# EAGLE design pointModule (EAGLE 5.11)
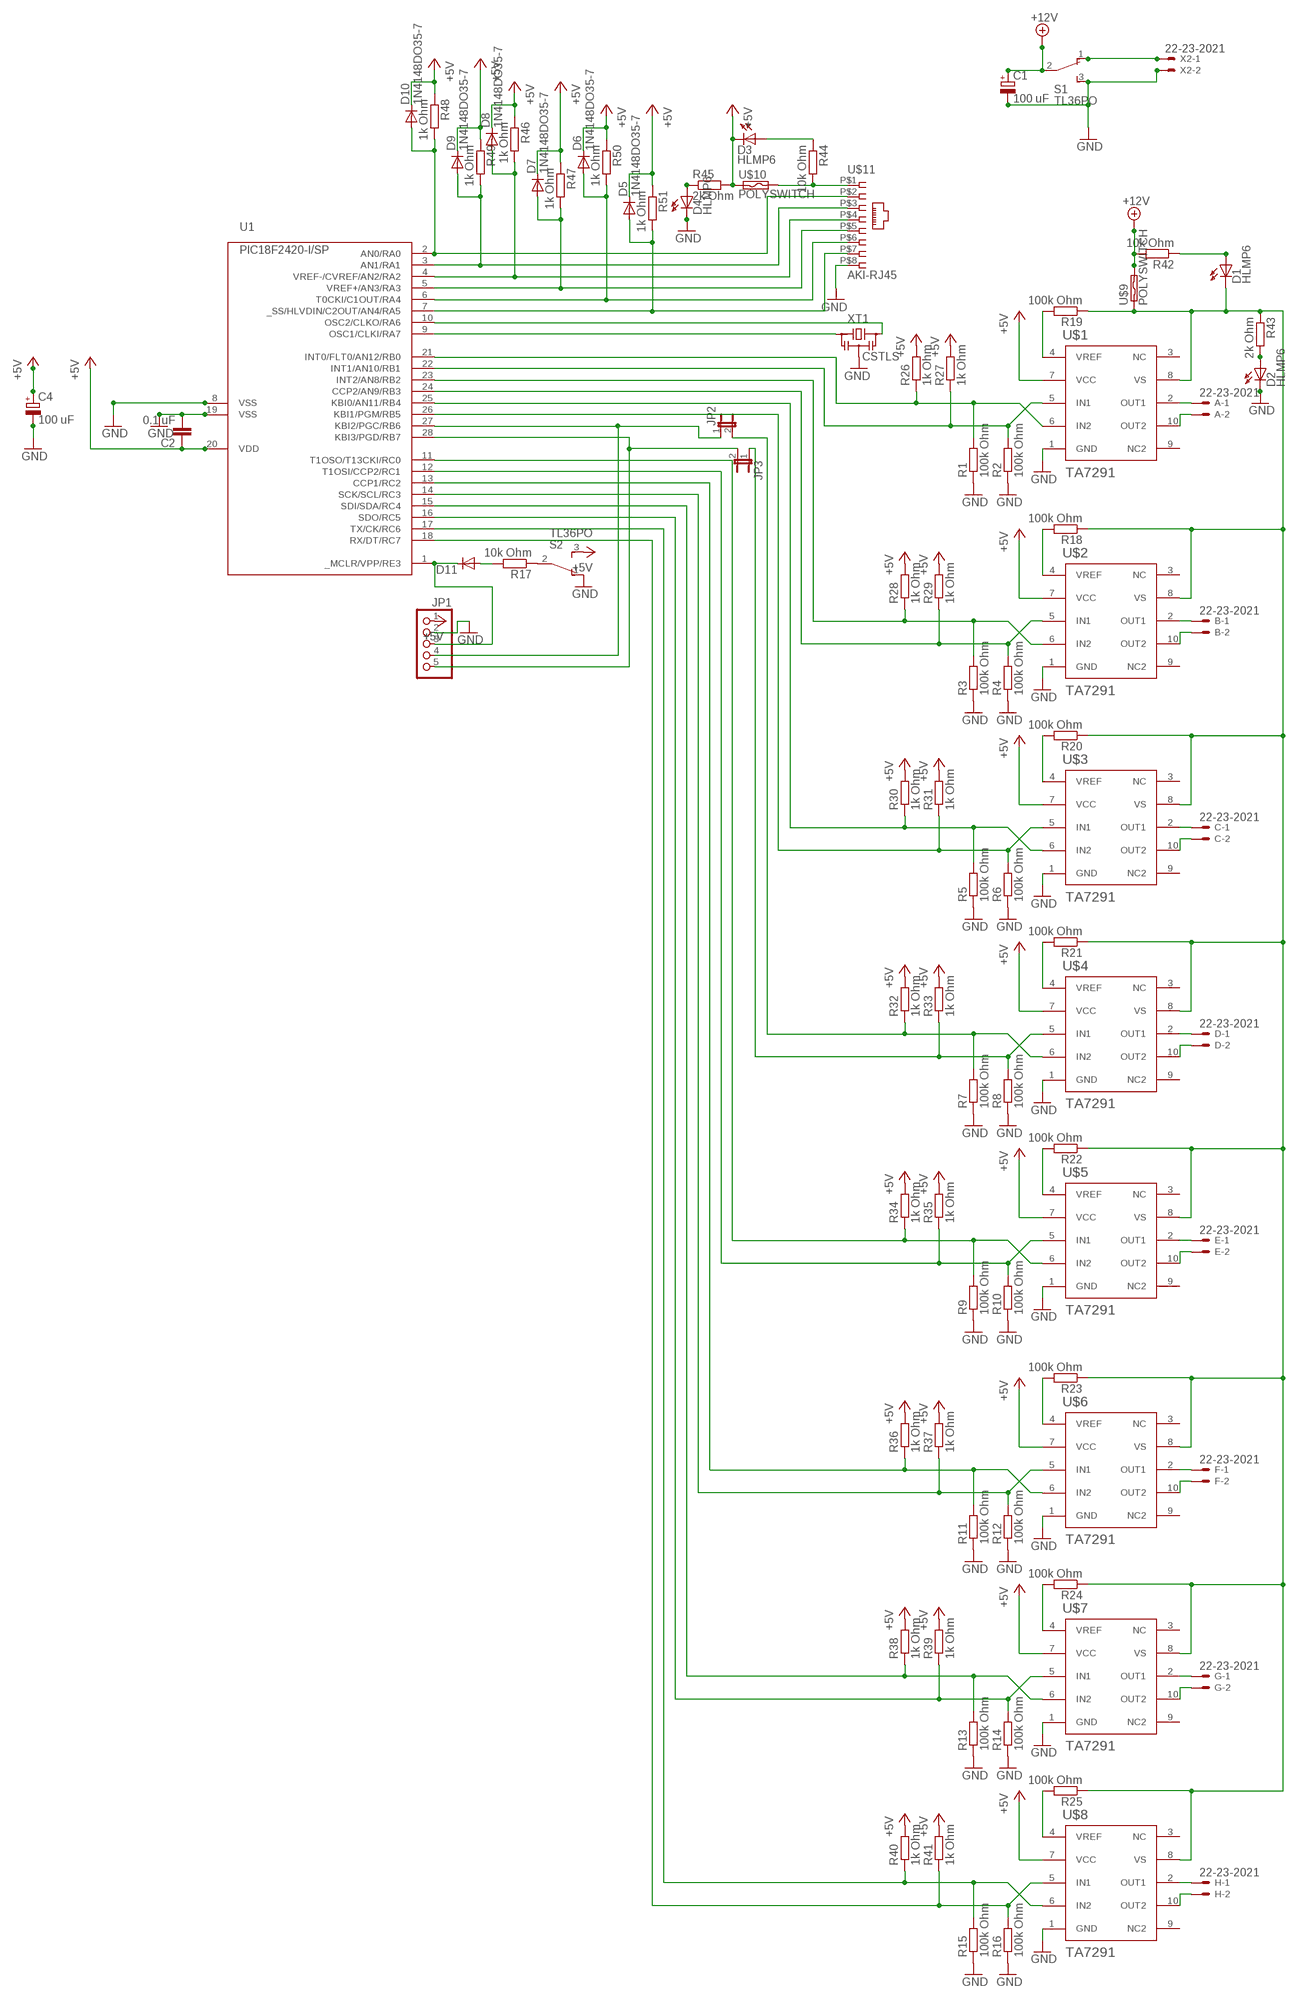
[diagram p0: schematic, sheet 1]

## Parts
A  22-23-2021  [22-23-2021]
B  22-23-2021  [22-23-2021]
C  22-23-2021  [22-23-2021]
C1  100 uF  CPOL-EUE2.5-5  [E2,5-5]
C2  0.1 uF  C2.5/2  [C2.5-2]
C4  100 uF  CPOL-EUE2.5-5  [E2,5-5]
D  22-23-2021  [22-23-2021]
D1  HLMP6  [HLMP6]
D2  HLMP6  [HLMP6]
D3  HLMP6  [HLMP6]
D4  HLMP6  [HLMP6]
D5  1N4148DO35-7  DIODE-D-2.5  [D-2.5]
D6  1N4148DO35-7  DIODE-D-2.5  [D-2.5]
D7  1N4148DO35-7  DIODE-D-2.5  [D-2.5]
D8  1N4148DO35-7  DIODE-D-2.5  [D-2.5]
D9  1N4148DO35-7  DIODE-D-2.5  [D-2.5]
D10  1N4148DO35-7  DIODE-D-2.5  [D-2.5]
D11  DIODE-D-2.5  [D-2.5]
E  22-23-2021  [22-23-2021]
F  22-23-2021  [22-23-2021]
G  22-23-2021  [22-23-2021]
H  22-23-2021  [22-23-2021]
JP1  PINHD-1X5  [1X05]
JP2  JP1E  [JP1]
JP3  JP1E  [JP1]
R1  100k Ohm  R-EU_0204/2V  [0204V]
R2  100k Ohm  R-EU_0204/2V  [0204V]
R3  100k Ohm  R-EU_0204/2V  [0204V]
R4  100k Ohm  R-EU_0204/2V  [0204V]
R5  100k Ohm  R-EU_0204/2V  [0204V]
R6  100k Ohm  R-EU_0204/2V  [0204V]
R7  100k Ohm  R-EU_0204/2V  [0204V]
R8  100k Ohm  R-EU_0204/2V  [0204V]
R9  100k Ohm  R-EU_0204/2V  [0204V]
R10  100k Ohm  R-EU_0204/2V  [0204V]
R11  100k Ohm  R-EU_0204/2V  [0204V]
R12  100k Ohm  R-EU_0204/2V  [0204V]
R13  100k Ohm  R-EU_0204/2V  [0204V]
R14  100k Ohm  R-EU_0204/2V  [0204V]
R15  100k Ohm  R-EU_0204/2V  [0204V]
R16  100k Ohm  R-EU_0204/2V  [0204V]
R17  10k Ohm  R-EU_0204/2V  [0204V]
R18  100k Ohm  R-EU_0204/2V  [0204V]
R19  100k Ohm  R-EU_0204/2V  [0204V]
R20  100k Ohm  R-EU_0204/2V  [0204V]
R21  100k Ohm  R-EU_0204/2V  [0204V]
R22  100k Ohm  R-EU_0204/2V  [0204V]
R23  100k Ohm  R-EU_0204/2V  [0204V]
R24  100k Ohm  R-EU_0204/2V  [0204V]
R25  100k Ohm  R-EU_0204/2V  [0204V]
R26  1k Ohm  R-EU_0204/2V  [0204V]
R27  1k Ohm  R-EU_0204/2V  [0204V]
R28  1k Ohm  R-EU_0204/2V  [0204V]
R29  1k Ohm  R-EU_0204/2V  [0204V]
R30  1k Ohm  R-EU_0204/2V  [0204V]
R31  1k Ohm  R-EU_0204/2V  [0204V]
R32  1k Ohm  R-EU_0204/2V  [0204V]
R33  1k Ohm  R-EU_0204/2V  [0204V]
R34  1k Ohm  R-EU_0204/2V  [0204V]
R35  1k Ohm  R-EU_0204/2V  [0204V]
R36  1k Ohm  R-EU_0204/2V  [0204V]
R37  1k Ohm  R-EU_0204/2V  [0204V]
R38  1k Ohm  R-EU_0204/2V  [0204V]
R39  1k Ohm  R-EU_0204/2V  [0204V]
R40  1k Ohm  R-EU_0204/2V  [0204V]
R41  1k Ohm  R-EU_0204/2V  [0204V]
R42  10k Ohm  R-EU_0204/2V  [0204V]
R43  2k Ohm  R-EU_0204/2V  [0204V]
R44  10k Ohm  R-EU_0204/2V  [0204V]
R45  2k Ohm  R-EU_0204/2V  [0204V]
R46  1k Ohm  R-EU_0204/2V  [0204V]
R47  1k Ohm  R-EU_0204/2V  [0204V]
R48  1k Ohm  R-EU_0204/2V  [0204V]
R49  1k Ohm  R-EU_0204/2V  [0204V]
R50  1k Ohm  R-EU_0204/2V  [0204V]
R51  1k Ohm  R-EU_0204/2V  [0204V]
S1  TL36PO  [TL3XPO]
S2  TL36PO  [TL3XPO]
U1  PIC18F2420-I/SP  [DIL28-3]
U$1  TA7291  [HSIP10]
U$2  TA7291  [HSIP10]
U$3  TA7291  [HSIP10]
U$4  TA7291  [HSIP10]
U$5  TA7291  [HSIP10]
U$6  TA7291  [HSIP10]
U$7  TA7291  [HSIP10]
U$8  TA7291  [HSIP10]
U$9  POLYSWITCH  [0207/2V]
U$10  POLYSWITCH  [0207/2V]
U$11  AKI-RJ45  [C-00159]
X2  22-23-2021  [22-23-2021]
XT1  CSTLS  [S3P]

## Nets
+5V: C2.1 C4.+ D3.K D5.C D6.C D7.C D8.C D9.C D10.C JP1.1 R26.2 R27.2 R28.2 R29.2 R30.2 R31.2 R32.2 R33.2 R34.2 R35.2 R36.2 R37.2 R38.2 R39.2 R40.2 R41.2 R45.2 R46.1 R47.1 R48.1 R49.1 R50.1 R51.1 S2.3(S) U1.20(VDD) U$1.7(VCC) U$2.7(VCC) U$3.7(VCC) U$4.7(VCC) U$5.7(VCC) U$6.7(VCC) U$7.7(VCC) U$8.7(VCC) U$10.1
+12V [12v]: C1.+ R42.2 S1.2(P) U$9.2
GND: C1.- C2.2 C4.- D2.K D4.K JP1.2 R1.1 R2.1 R3.1 R4.1 R5.1 R6.1 R7.1 R8.1 R9.1 R10.1 R11.1 R12.1 R13.1 R14.1 R15.1 R16.1 S1.3(S) S2.1(O) U1.8(VSS) U1.19(VSS) U$1.1(GND) U$2.1(GND) U$3.1(GND) U$4.1(GND) U$5.1(GND) U$6.1(GND) U$7.1(GND) U$8.1(GND) U$11.P$8 X2.2 XT1.P$2
N$1 [12v]: S1.1(O) X2.1
N$2 [signal]: D6.A R50.2 U1.6(T0CKI/C1OUT/RA4) U$11.P$6
N$3: D5.A R51.2 U1.7(_SS/HLVDIN/C2OUT/AN4/RA5) U$11.P$7
N$4: D11.C JP1.3 U1.1(_MCLR/VPP/RE3)
N$5: JP1.5 JP3.2 U1.28(KBI3/PGD/RB7)
N$6: R17.1 S2.2(P)
N$7: R18.2 U$2.4(VREF)
N$8: R1.2 R26.1 U1.21(INT0/FLT0/AN12/RB0) U$1.6(IN2)
N$9: U1.9(OSC1/CLKI/RA7) XT1.P$1
N$10: U1.10(OSC2/CLKO/RA6) XT1.P$3
N$11: R2.2 R27.1 U1.22(INT1/AN10/RB1) U$1.5(IN1)
N$12 [12v]: A.1 U$1.2(OUT1)
N$13 [12v]: A.2 U$1.10(OUT2)
N$14: D11.A R17.2
N$15: R4.2 R29.1 U1.24(CCP2/AN9/RB3) U$2.5(IN1)
N$16 [12v]: B.1 U$2.2(OUT1)
N$17 [12v]: B.2 U$2.10(OUT2)
N$18: JP1.4 JP2.1 U1.27(KBI2/PGC/RB6)
N$19: R6.2 R31.1 U1.26(KBI1/PGM/RB5) U$3.5(IN1)
N$20 [12v]: C.1 U$3.2(OUT1)
N$21 [12v]: C.2 U$3.10(OUT2)
N$23: JP3.1 R8.2 R33.1 U$4.5(IN1)
N$24 [12v]: D.1 U$4.2(OUT1)
N$25 [12v]: D.2 U$4.10(OUT2)
N$26 [signal]: D8.A R46.2 U1.4(VREF-/CVREF/AN2/RA2) U$11.P$4
N$27: R10.2 R35.1 U1.12(T1OSI/CCP2/RC1) U$5.5(IN1)
N$28 [12v]: E.1 U$5.2(OUT1)
N$29 [12v]: E.2 U$5.10(OUT2)
N$31: R12.2 R37.1 U1.14(SCK/SCL/RC3) U$6.5(IN1)
N$32 [12v]: F.1 U$6.2(OUT1)
N$33 [12v]: F.2 U$6.10(OUT2)
N$34 [signal]: D7.A R47.2 U1.5(VREF+/AN3/RA3) U$11.P$5
N$35: R14.2 R39.1 U1.16(SDO/RC5) U$7.5(IN1)
N$36 [12v]: G.1 U$7.2(OUT1)
N$37 [12v]: G.2 U$7.10(OUT2)
N$39: R16.2 R41.1 U1.18(RX/DT/RC7) U$8.5(IN1)
N$40 [12v]: H.1 U$8.2(OUT1)
N$41 [12v]: H.2 U$8.10(OUT2)
N$42: R19.2 U$1.4(VREF)
N$43 [signal]: D10.A R48.2 U1.2(AN0/RA0) U$11.P$2
N$44: R20.2 U$3.4(VREF)
N$45: R21.2 U$4.4(VREF)
N$46: R22.2 U$5.4(VREF)
N$47: R23.2 U$6.4(VREF)
N$48: R24.2 U$7.4(VREF)
N$49: R25.2 U$8.4(VREF)
N$50: R3.2 R28.1 U1.23(INT2/AN8/RB2) U$2.6(IN2)
N$51: R5.2 R30.1 U1.25(KBI0/AN11/RB4) U$3.6(IN2)
N$52: JP2.2 R7.2 R32.1 U$4.6(IN2)
N$53: R9.2 R34.1 U1.11(T1OSO/T13CKI/RC0) U$5.6(IN2)
N$54: R11.2 R36.1 U1.13(CCP1/RC2) U$6.6(IN2)
N$55: R13.2 R38.1 U1.15(SDI/SDA/RC4) U$7.6(IN2)
N$56: R15.2 R40.1 U1.17(TX/CK/RC6) U$8.6(IN2)
N$57 [signal]: D9.A R49.2 U1.3(AN1/RA1) U$11.P$3
N$66: D2.A R43.2
N$67: D1.A R42.1
N$68: R44.2 U$10.2 U$11.P$1
N$69: D3.A R44.1
N$70: D4.A R45.1
N$72 [12v]: D1.K R18.1 R19.1 R20.1 R21.1 R22.1 R23.1 R24.1 R25.1 R43.1 U$1.8(VS) U$2.8(VS) U$3.8(VS) U$4.8(VS) U$5.8(VS) U$6.8(VS) U$7.8(VS) U$8.8(VS) U$9.1
Unconnected: U$1.3(NC) U$1.9(NC2) U$2.3(NC) U$2.9(NC2) U$3.3(NC) U$3.9(NC2) U$4.3(NC) U$4.9(NC2) U$5.3(NC) U$5.9(NC2) U$6.3(NC) U$6.9(NC2) U$7.3(NC) U$7.9(NC2) U$8.3(NC) U$8.9(NC2)

## Library data of the parts
A B C D E F G H X2 = con-molex:22-23-2021: .100" (2.54mm) Center Header - 2 Pin; MF: MOLEX; MPN: 22-23-2021; OC_FARNELL: 1462926; OC_NEWARK: 25C3832
C1 C4 = rcl:CPOL-EU: POLARIZED CAPACITOR, European symbol
C2 = capacitor-wima:C: CAPACITOR naming: grid - package width
D1-D4 = display-hp:HLMP6: LED 2mm horizontal; MF: AGILENT TECHNOLOGIES; MPN: HLMP-6500; OC_FARNELL: 1652490; OC_NEWARK: 40K0088
D5-D11 = diode:DIODE-: DIODE
JP1 = pinhead:PINHD-1X5: PIN HEADER
JP2 JP3 = jumper:JP1E: JUMPER
R1-R51 = rcl:R-EU_: RESISTOR, European symbol
S1 S2 = switch:TL36PO: TINY SWITCH ON - ON Source: http://www2.produktinfo.conrad.com/datenblaetter/700000-724999/705152-da-01-de-Subminiaturschalter_TL_36YO.pdf
U1 = pic18fxx20:PIC18*2420: PIC18*2420 Microchip FLASH Microcontroller with A/D DEVICE FEATURES Feature PIC18*2420 Program Memory (bytes) 16384 Program Memory (instructions) 8192 Interupt Sources 19 I/O Ports Ports A, B, C, (E) Capture/Compare/PWM Modules 2 Enhanced Capture/Compare/PWM Modules 0 Parallel Communications (PSP) No 10-bit Analog-to-Digital Module 10 input Channels Package Types 28-pin PDIP 28-pin SOIC 28-pin QFN NOTES: F only after 18, means standard voltage range from 4.2v to 5.5v LF after 18, means extended voltage range from 2.0v to 5.5v -E before / denotes extended temperature range from -40°C to +120°C -I before / denotes industrial temperature range from -40°C to +85°C /PT suffix denotes TQFP package /SO suffix denotes SOIC package /SP suffix denotes Skinny Plastic DIP package /P suffix denotes Plastic DIP package /ML suffix denotes QFN package T after entire device number, means supplied in tape and reel TQFP packages only
U$1-U$8 = TA7291P:TA7291
U$9 U$10 = myparts:POLYSWITCH
U$11 = myparts:AKI-RJ45
XT1 = TOG:CSTLS: Resonator, Murata Ceralock

## Net classes
1 12v: width 0.508 mm

## Board
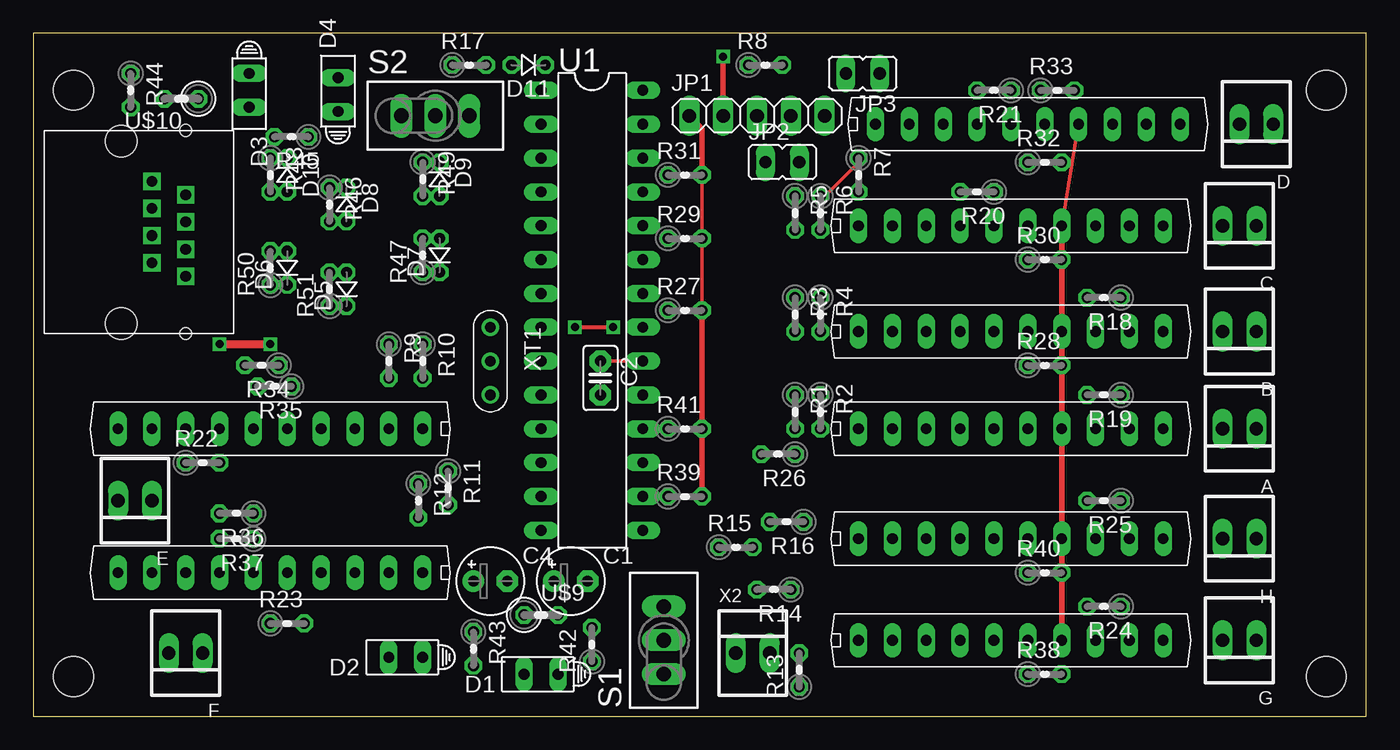
[diagram p1: board, top side]
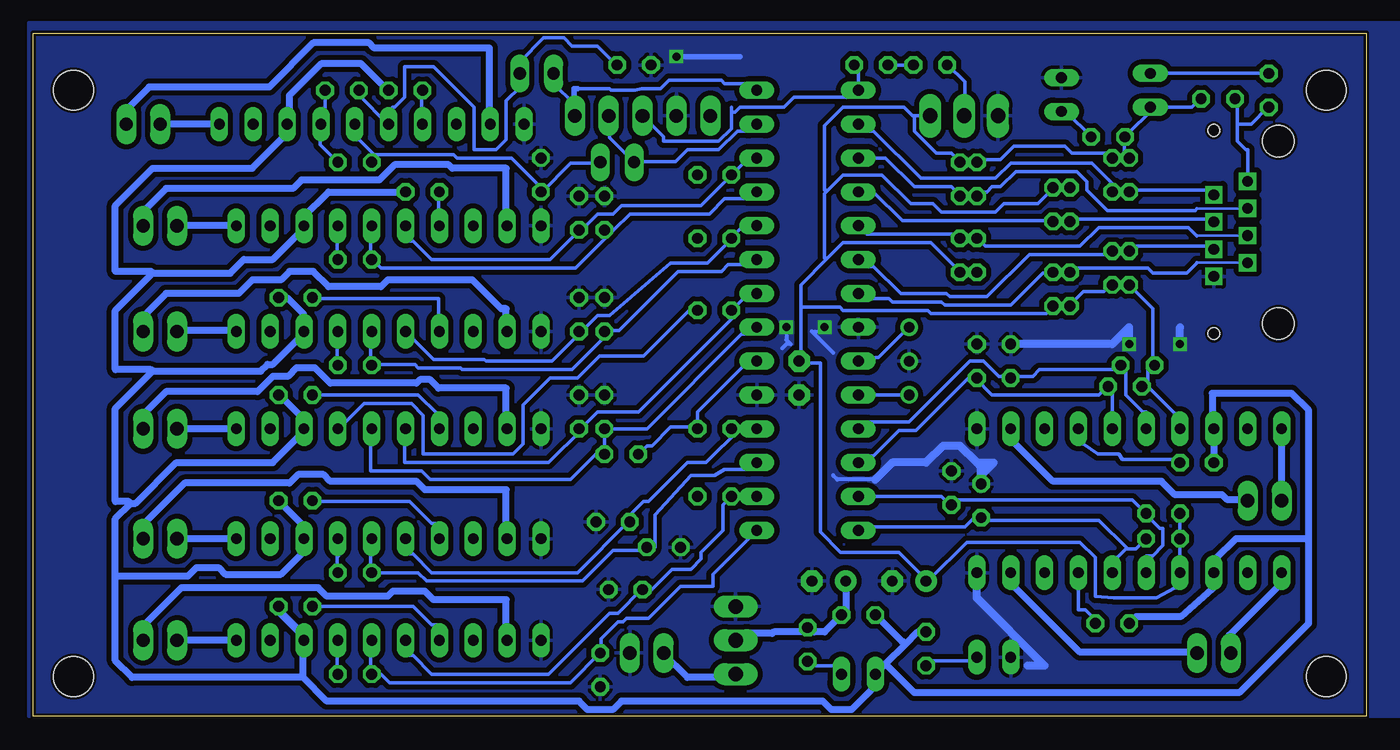
[diagram p2: board, bottom side, seen from below]

Size 100 x 51.27 mm. Coordinates in mm from the lower left corner, seen from the top.
Outline: 0,0 100,0 100,51.27 0,51.27 0,0
Copper layers (1*16): Top 0.035mm / dielectric 1.5mm / Bottom 0.035mm
Design rules "default *": minimum track width 10mil, minimum drill 24mil, track to track 15mil, track to pad 15mil, pad to pad 15mil, via to via 15mil, smd to smd 15mil, copper to edge 8mil, drill to drill 8mil, minimum pad ring 10mil, minimum via ring 8mil, stop-mask expansion 4mil, vias tented up to drill 0mil, thermal gap 10mil
Holes 3 mm at 3,47 97,47 97,3 3,3

### Footprints (pad centres in the part's own frame; a part is rotated, then mirrored left to right if it is on the bottom)
22-23-2021 = drill 1 long: 1 -1.27,0; 2 1.27,0
E2,5-5 = drill 0.813 pad 1.6 round: + -1.27,0 | drill 0.813 pad 1.6 octagon: - 1.27,0
C2.5-2 = drill 0.813 pad 1.6 octagon: 1 -1.27,0; 2 1.27,0
HLMP6 = drill 0.813 long: A -1.27,0; K 1.27,0
D-2.5 = drill 0.813 octagon: A 1.27,0; C -1.27,0
1X05 = drill 1.016 long: 1 -5.08,0; 2 -2.54,0; 3 0,0; 4 2.54,0; 5 5.08,0
JP1 = drill 0.914 long: 1 0,-1.27; 2 0,1.27
0204V = drill 0.813 octagon: 1 -1.27,0; 2 1.27,0
TL3XPO = drill 1.1 pad 1.422 long: 1 -2.54,0; 2 0,0; 3 2.54,0
DIL28-3 = drill 0.813 long: 1 -16.51,-3.81; 2 -13.97,-3.81; 3 -11.43,-3.81; 4 -8.89,-3.81; 5 -6.35,-3.81; 6 -3.81,-3.81; 7 -1.27,-3.81; 8 1.27,-3.81; 9 3.81,-3.81; 10 6.35,-3.81; 11 8.89,-3.81; 12 11.43,-3.81; 13 13.97,-3.81; 14 16.51,-3.81; 15 16.51,3.81; 16 13.97,3.81; 17 11.43,3.81; 18 8.89,3.81; 19 6.35,3.81; 20 3.81,3.81; 21 1.27,3.81; 22 -1.27,3.81; 23 -3.81,3.81; 24 -6.35,3.81; 25 -8.89,3.81; 26 -11.43,3.81; 27 -13.97,3.81; 28 -16.51,3.81
HSIP10 = drill 0.8 long: 1 -11.43,0; 2 -8.89,0; 3 -6.35,0; 4 -3.81,0; 5 -1.27,0; 6 1.27,0; 7 3.81,0; 8 6.35,0; 9 8.89,0; 10 11.43,0
0207/2V = drill 0.813 octagon: 1 -1.27,0; 2 1.27,0
C-00159 = drill 0.8 square: P$1 0,0.8; P$2 2.54,-0.22; P$3 0,-1.24; P$4 2.54,-2.26; P$5 0,-3.28; P$6 2.54,-4.3; P$7 0,-5.32; P$8 2.54,-6.34 | hole 2.4: -2.3,-9.885; -2.3,3.805 | hole 0.9: 2.54,4.605; 2.54,-10.635
S3P = drill 0.8 round: P$1 -2.54,0; P$2 0,0; P$3 2.54,0

### Placement (x,y rotation side)
A  90.49,21.59 180 top
B  90.49,28.89 180 top
C  90.49,36.83 180 top
C1  40.32,10.16 0 top
C2  42.55,25.4 270 top
C4  34.29,10.16 0 top
D  91.76,44.45 180 top
D1  38.1,3.17 180 top
D2  27.94,4.45 180 top
D3  16.19,46.99 270 top
D4  22.86,46.67 90 top
D5  23.5,32.07 90 top
D6  19.05,33.66 90 top
D7  30.48,34.61 90 top
D8  23.5,38.42 270 top
D9  30.48,40.32 270 top
D10  19.05,40.64 270 top
D11  37.15,48.9 180 top
E  7.62,16.19 180 top
F  11.43,4.76 180 top
G  90.49,5.71 180 top
H  90.49,13.34 180 top
JP1  54.29,45.09 0 top
JP2  56.2,41.59 270 top
JP3  62.23,48.26 90 top
R1  57.15,22.86 270 top
R2  59.05,22.86 270 top
R3  57.15,30.16 270 top
R4  59.05,30.16 270 top
R5  57.15,37.78 270 top
R6  59.05,37.78 270 top
R7  61.91,40.64 270 top
R8  54.93,48.9 0 top
R9  26.67,26.67 270 top
R10  29.21,26.67 270 top
R11  31.11,17.14 270 top
R12  28.89,16.19 270 top
R13  57.47,3.49 90 top
R14  55.56,9.53 180 top
R15  52.7,12.7 0 top
R16  56.52,14.61 180 top
R17  32.7,48.9 0 top
R18  80.33,31.43 180 top
R19  80.33,24.13 180 top
R20  70.8,39.37 180 top
R21  72.07,46.99 180 top
R22  12.7,19.05 0 top
R23  19.05,6.99 0 top
R24  80.33,8.26 180 top
R25  80.33,16.19 180 top
R26  55.88,19.68 180 top
R27  48.9,30.48 0 top
R28  75.88,26.35 0 top
R29  48.9,35.88 0 top
R30  75.88,34.29 0 top
R31  48.9,40.64 0 top
R32  75.88,41.59 0 top
R33  76.83,46.99 0 top
R34  17.14,26.35 180 top
R35  18.1,24.77 180 top
R36  15.24,15.24 180 top
R37  15.24,13.34 180 top
R38  75.88,3.17 0 top
R39  48.9,16.51 0 top
R40  75.88,10.79 0 top
R41  48.9,21.59 0 top
R42  41.91,5.4 90 top
R43  33.02,5.08 270 top
R44  7.3,46.99 270 top
R45  19.37,43.5 180 top
R46  22.23,38.42 270 top
R47  29.21,34.61 90 top
R48  17.78,40.64 270 top
R49  29.21,40.32 270 top
R50  17.78,33.66 90 top
R51  22.23,32.07 90 top
S1  47.31,5.71 90 top
S2  30.16,45.09 0 top
U1  41.91,30.48 270 top
U$1  73.34,21.59 0 top
U$2  73.34,28.89 0 top
U$3  73.34,36.83 0 top
U$4  74.61,44.45 0 top
U$5  17.78,21.59 180 top
U$6  17.78,10.79 180 top
U$7  73.34,5.71 0 top
U$8  73.34,13.34 0 top
U$9  38.1,7.62 0 top
U$10  11.11,46.35 180 top
U$11  8.89,39.37 0 top
X2  53.98,4.76 0 top
XT1  34.29,26.67 270 top

### Tracks (layer width: path | path; a pad name or v marks a point on that pad's centre or on a via)
+5V
  Top 0.254: C2.1 U1.20 | U$3.7 U$4.7 | R31.2 R29.2 R27.2
  Top 0.406: U$3.7 U$2.7 U$1.7 U$8.7 U$7.7 | R39.2 R41.2 R27.2 | R31.2 50.16,44.13 JP1.1
  Bottom 0.254: 16.26,25.91 15.88,26.29 R34.2 | R30.2 77.22,34.29 77.22,36.83 U$3.7 | 77.09,12.06 77.09,13.34 U$8.7 77.09,12.06 | U1.20 46.35,26.67 50.16,22.86 50.16,21.72 | R26.2 53.98,20.32 53.59,20.32 52.2,21.72 50.16,21.72 | 50.16,21.72 R41.2 | D8.C R46.1 | D8.C 23.5,39.75 | R38.2 77.22,3.17 77.22,5.71 U$7.7 | 77.09,12.06 77.22,12.06 77.22,10.79 R40.2 | R28.2 77.22,26.42 77.22,28.83 U$2.7 | 33.02,10.29 32.77,10.29 29.97,13.08 21.46,13.08 20.32,11.94 20.32,9.02 18.92,8.89 15.75,8.89 14.35,9.65 13.97,9.65 U$6.7 R37.2 R36.2 | 33.02,10.29 35.05,12.32 39.43,12.32 40.96,13.84 40.96,26.54 42.42,26.54 C2.1 42.42,26.67 42.42,30.73 | 33.02,10.29 C4.+ | D9.C R49.1 | U$5.7 13.97,22.73 14.35,22.73 16.38,24.77 | 16.38,24.77 R35.2 16.76,24.77 | 16.38,24.77 16.38,26.04 16.13,26.29 R34.2 | 22.23,30.86 23.5,30.86 D5.C 23.5,30.73 24,30.23 32.64,30.23 32.89,30.48 39.24,30.48 39.5,30.73 42.42,30.73 | 22.23,30.86 21.21,31.88 19.68,31.88 19.18,32.38 D6.C R50.1 16,30.61 16,26.42 R34.2 | 22.23,30.86 R51.1 | 18.16,41.91 D10.C 19.43,42.29 22.1,42.29 22.61,42.8 26.42,42.8 27.43,41.78 30.48,41.78 D9.C | D9.C 30.48,41.66 31.11,42.29 32.26,42.29 33.91,43.94 33.91,45.09 S2.3 34.04,45.09 34.67,45.72 39.24,45.72 40.64,44.32 40.64,39.5 40.51,39.5 40.45,39.43 | R32.2 78.49,42.93 78.49,44.45 U$4.7 78.11,44.45 R33.2 | 30.48,33.4 29.21,33.4 R47.1 | 30.48,33.4 32.64,35.56 39.24,35.56 40.45,34.35 | 40.45,34.35 42.42,32.38 42.42,30.73 | 30.48,33.4 D7.C | 40.45,39.43 40.64,39.24 40.64,34.42 40.51,34.42 40.45,34.35 | 40.45,39.43 39.24,40.64 36.32,40.64 34.16,38.48 32.51,38.48 31.88,37.85 27.81,37.85 27.18,38.48 24.64,38.48 23.5,39.62 D8.C
  Bottom 0.254: 18.16,41.91 18.16,43.43 R45.2 15.88,45.72 | 18.16,41.91 R48.1 | 15.88,45.72 13.08,45.72 12.45,46.35 U$10.1 | 15.88,45.72 D3.K 16.13,45.72 | R27.2 50.8,30.48 54.23,27.05 57.53,27.05 59.18,25.4 61.21,25.4 63.25,23.37 63.25,20.45 64.01,19.68 70.74,19.68 70.74,22.61 71.63,23.5 75.18,23.5 77.09,21.59 U$1.7
+12V
  Bottom 0.508: C1.+ 38.99,10.16 38.99,7.75 39.24,7.75 U$9.2 40.64,6.35 41.4,6.35 41.66,6.6 41.91,6.6 R42.2 41.66,6.35 44.45,6.35 44.58,6.22 46.74,6.22 47.24,5.71 S1.2
GND  (via drill 0.6)
  Top 0.254: R7.1 62.23,41.91 59.69,39.37 R6.1
  Top 0.305: v40.64,29.21 v43.5,29.21
  Top 0.406: JP1.2 v51.75,49.53
  Top 0.61: v13.97,27.94 v17.78,27.94
  Bottom 0.305: 36.83,17.78 39.69,17.78 40.01,18.1 | 40.01,27.3 41.59,28.89 40.96,28.89 v40.64,29.21 | v43.5,29.21 43.5,28.26 43.18,27.94 43.5,27.94 43.81,27.62
  Bottom 0.406: v51.75,49.53 46.99,49.53
  Bottom 0.61: R9.1 19.05,27.94 17.78,29.21 v17.78,27.94 | v13.97,27.94 13.97,29.21 | 29.21,19.05 27.94,19.05 28.89,18.1 R12.1 28.89,18.73 29.21,19.05 | U$6.1 29.21,8.89 24.13,3.81 25.4,3.81 | 29.21,19.05 30.48,20.32 31.75,20.32 33.02,19.05 35.56,19.05 36.83,17.78
  pour Bottom: -2.54,52.07 -2.54,0 100.33,0 100.33,52.07
N$1
  Bottom 0.508: X2.1 52.7,4.7 50.93,2.92 47.62,2.92 47.37,3.17 S1.1
N$2
  Bottom 0.254: U$11.P$6 11.43,35.18 11.56,35.31 17.27,35.31 17.65,34.92 R50.2 D6.A 19.43,34.92 19.68,34.67 25.27,34.67 28.45,31.5 31.24,31.5 31.5,31.75 34.92,31.75 36.96,33.78 37.59,33.78 U1.6
N$3
  Bottom 0.2: U$11.P$7 12.7,34.05
  Bottom 0.254: 22.23,33.4 23.5,33.4 D5.A 23.5,33.27 24.26,33.27 26.67,30.86 31.62,30.86 31.88,31.11 35.56,31.11 35.81,31.37 37.72,31.37 U1.7 | 22.23,33.4 21.84,33.4 21.59,33.66 16.38,33.66 16,33.27 13.46,33.27 12.7,34.04 12.7,34.05 | 22.23,33.4 R51.2
N$4
  Bottom 0.254: 47.62,45.34 47.62,44.13 48.58,43.18 52.7,43.18 52.7,43.5 JP1.3 | 47.62,45.34 47.62,45.72 | D11.C 38.1,48.9 U1.1 38.61,46.48 42.93,46.48 43.69,45.72 46.99,45.72 47.37,45.34 47.62,45.34
N$5
  Bottom 0.254: U1.28 46.23,47.5 48.13,47.5 48.39,47.75 52.32,47.75 52.96,47.12 54.36,47.12 54.86,46.99 56.64,46.99 56.77,47.12 59.18,47.12 | JP1.5 59.44,45.09 59.44,45.72 59.44,46.35 59.82,46.35 60.58,47.12 60.58,48.26 JP3.2
  Bottom 0.406: 59.18,47.12 59.44,47.12 59.44,45.72
N$6
  Bottom 0.254: R17.1 31.37,48.9 30.1,47.62 30.1,45.09 S2.2
N$7
  Bottom 0.254: U$2.4 69.6,28.96 69.6,31.37 78.99,31.37 R18.2
N$8
  Bottom 0.254: U$1.6 74.68,21.59 74.68,18.41 70.87,18.41 70.23,17.78 59.69,17.78 57.78,19.68 R26.1 R1.2 53.98,21.59 46.86,28.7 46.23,28.7 U1.21
N$9
  Bottom 0.254: XT1.P$1 36.58,26.92 36.83,26.92 37.08,26.67 U1.9
N$10
  Bottom 0.254: XT1.P$3 U1.10
N$11
  Bottom 0.254: U1.22 46.35,31.75 R27.1 47.62,29.84 54.61,22.86 57.66,22.86 58.93,21.59 R2.2 58.8,21.59 61.34,19.05 72.14,19.05 72.14,21.59 U$1.5
N$12
  Bottom 0.508: U$1.2 64.52,21.59 64.52,24.64 69.6,24.64 70.23,25.27 70.99,25.27 71.25,25.02 77.72,25.02 78.87,26.16 80.26,26.16 80.9,25.53 82.04,25.53 83.19,24.38 90.04,24.38 91.69,22.73 91.69,21.59 A.1
N$13
  Bottom 0.508: U$1.10 A.2
N$14
  Bottom 0.254: R17.2 D11.A
N$15
  Bottom 0.254: U1.24 46.74,36.83 47.62,35.94 R29.1 47.62,35.81 49.4,34.04 52.2,34.04 56.77,30.1 57.66,30.1 58.8,28.96 59.05,28.96 R4.2 59.05,28.7 61.09,26.67 66.04,26.67 66.17,26.8 69.98,26.8 U$2.5
N$16
  Bottom 0.508: U$2.2 64.52,28.96 64.52,30.61 64.9,30.61 67.06,32.77 73.41,32.77 73.91,32.26 77.85,32.26 78.99,33.4 80.77,33.4 81.41,32.77 83.57,32.77 84.58,31.75 90.04,31.75 91.69,30.1 91.69,28.96 B.1
N$17
  Bottom 0.508: U$2.10 84.84,28.96 89.15,28.96 B.2
N$18
  Bottom 0.254: U1.27 46.23,43.94 47.18,43.94 48.58,42.55 50.93,42.55 51.82,41.66 54.86,41.66 JP2.1 56.77,43.43 56.77,45.09 JP1.4
N$19
  Bottom 0.254: U1.26 46.35,41.91 R31.1 49.91,38.35 55.88,38.35 56.52,37.72 57.66,37.72 58.8,36.58 59.05,36.58 R6.2 59.05,36.45 61.21,34.29 70.1,34.29 71.5,35.69 72.01,35.69 72.01,36.83 U$3.5
N$20
  Bottom 0.508: U$3.2 64.52,36.83 64.52,41.15 68.58,41.15 68.83,41.4 72.9,41.4 74.04,40.26 79.88,40.26 80.52,39.62 90.04,39.62 91.69,37.97 91.69,36.83 C.1
N$21
  Bottom 0.508: U$3.10 C.2
N$23
  Bottom 0.254: R33.1 75.56,46.61 73.41,44.45 U$4.5 73.79,44.96 73.03,45.72 72.9,45.72 72.14,46.48 72.14,48.77 69.98,48.77 66.93,45.72 66.93,42.55 65.28,42.55 64.52,43.31 64.52,46.23 63.5,47.24 JP3.1 63.5,49.15 61.72,50.93 60.2,50.93 59.56,50.29 57.66,50.29 56.26,48.9 R8.2
N$24
  Bottom 0.508: U$4.2 65.79,44.45 65.79,50.16 74.42,50.16 74.8,50.55 78.99,50.55 82.3,47.24 91.31,47.24 92.96,45.59 92.96,44.45 D.1
N$25
  Bottom 0.508: U$4.10 D.2
N$26
  Bottom 0.254: 22.23,37.21 23.5,37.21 | 23.5,37.21 34.8,37.21 36.96,39.37 U1.4 | 23.5,37.21 D8.A | 22.23,37.21 22.1,37.34 11.56,37.34 11.43,37.21 U$11.P$4 | 22.23,37.21 R46.2
N$27
  Bottom 0.254: U$5.5 19.05,24.77 R35.1 19.43,24.77 20.07,24.13 28.07,24.13 29.34,25.4 | U1.12 37.59,19.56 36.96,19.56 35.05,21.46 33.78,21.46 29.84,25.4 29.34,25.4 | 29.34,25.4 R10.2
N$28
  Bottom 0.508: U$5.2 26.67,20.57 26.42,20.57 23.5,17.65 15.37,17.65 14.35,16.64 10.79,16.64 10.41,16.26 8.89,16.26 E.1
N$29
  Bottom 0.508: E.2 U$5.10
N$31
  Bottom 0.254: U$6.5 19.05,11.94 18.67,11.94 17.97,12.64 | U1.14 37.85,14.22 30.1,14.22 29.46,14.86 28.96,14.86 R12.2 29.46,14.73 20.07,14.73 17.97,12.64 | R37.1 17.27,12.57 17.91,12.57 17.97,12.64
N$32
  Bottom 0.508: U$6.2 26.67,9.78 26.42,9.78 21.46,4.83 12.7,4.83 F.1
N$33
  Bottom 0.508: U$6.10 6.35,9.78 6.6,9.78 10.29,6.1 10.29,4.83 10.16,4.83 F.2
N$34
  Bottom 0.2: U$11.P$5 12.7,36.09
  Bottom 0.254: 30.48,35.94 29.21,35.94 R47.2 29.21,35.81 29.08,35.81 28.57,35.31 21.46,35.31 20.07,36.7 13.34,36.7 12.7,36.07 12.7,36.09 | U1.5 37.47,36.2 30.73,36.2 30.48,35.94 | 30.48,35.94 D7.A
N$35
  Bottom 0.254: U1.16 R39.1 48.26,15.88 48.26,13.97 49.91,12.32 49.91,11.81 50.67,11.05 52.07,11.05 53.59,9.53 R14.2 54.36,9.53 56.13,7.75 56.77,7.75 61.34,3.17 70.1,3.17 71.5,4.57 72.01,4.57 72.01,5.71 U$7.5
N$36
  Bottom 0.508: U$7.2 64.52,5.71 64.52,8.76 69.98,8.76 70.61,9.4 73.03,9.4 73.41,9.02 77.98,9.02 78.61,9.65 88.9,9.65 91.69,6.86 91.69,5.71 G.1
N$37
  Bottom 0.508: 84.84,5.78 U$7.10 G.2
N$39
  Bottom 0.254: R41.1 46.99,21.59 | 46.99,21.59 U1.18 | 46.99,21.59 49.53,19.05 50.93,19.05 53.85,16.13 54.23,16.13 55.24,15.11 R16.2 55.37,14.61 59.18,10.79 70.1,10.79 71.5,12.19 72.01,12.19 72.01,13.34 U$8.5
N$40
  Bottom 0.508: U$8.2 64.52,13.34 64.52,17.02 70.61,17.02 71.25,17.65 77.72,17.65 78.23,18.16 80.14,18.16 80.77,17.53 88.65,17.53 91.69,14.48 91.69,13.34 H.1
N$41
  Bottom 0.508: U$8.10 H.2
N$42
  Bottom 0.254: 69.47,21.65 U$1.4 69.47,21.72 69.47,22.73 69.72,22.73 71.12,24.13 R19.2
N$43
  Bottom 0.254: D10.A R48.2 | 18.54,39.5 11.68,39.5 11.43,39.24 U$11.P$2 | 18.54,39.5 19.18,39.5 D10.A | U1.2 37.59,43.94 36.96,43.94 33.4,40.39 27.81,40.39 26.67,41.53 20.57,41.53 18.54,39.5 | 18.54,39.5 D10.A
N$44
  Bottom 0.254: U$3.4 69.6,36.83 69.6,39.37 R20.2
N$45
  Bottom 0.254: U$4.4 70.87,44.45 70.87,46.99 R21.2
N$46
  Bottom 0.254: U$5.4 21.59,20.45 21.21,20.45 20.13,19.68 18.54,19.68 18.29,19.3 13.97,19.3 R22.2
N$47
  Bottom 0.254: U$6.4 21.59,8 21.08,8 20.32,7.24 R23.2
N$48
  Bottom 0.254: U$7.4 69.6,5.71 69.6,6.86 70.1,6.86 71.5,8.26 R24.2
N$49
  Bottom 0.254: U$8.4 69.6,13.34 69.6,14.48 70.1,14.48 71.75,16.13 78.99,16.13 R25.2
N$50
  Bottom 0.254: U1.23 46.1,33.91 47.88,33.91 48.39,33.4 51.63,33.4 56.07,28.96 56.64,28.96 | 56.64,28.96 57.15,28.96 R3.2 56.64,28.96 | U$2.6 74.68,28.83 74.68,26.42 R28.1 74.55,26.42 71.37,26.42 71.12,26.16 67.94,26.16 67.82,26.04 59.56,26.04 56.64,28.96
N$51
  Bottom 0.254: U$3.6 74.68,36.83 74.68,34.29 R30.1 74.55,34.29 73.91,33.66 59.31,33.66 56.39,36.58 | U1.25 46.23,38.86 48.13,38.86 49.28,37.72 55.24,37.72 56.39,36.58 | 56.39,36.58 57.15,36.58 R5.2
N$52
  Bottom 0.254: 74.42,42.16 75.56,43.31 75.82,43.31 75.82,44.45 U$4.6 | 74.42,42.16 74.42,41.66 74.55,41.66 R32.1 74.42,42.16 | JP2.2 57.53,41.53 59.69,41.53 61.85,39.37 R7.2 61.72,39.62 61.85,39.62 64.14,41.91 68.2,41.91 68.45,42.16 74.42,42.16
N$53
  Bottom 0.254: U$5.6 16.51,22.86 16.76,22.86 18.03,24.13 18.03,26.29 18.41,26.29 | U1.11 37.59,22.1 34.29,22.1 29.72,26.67 28.7,26.67 27.56,25.53 26.8,25.53 R9.2 26.67,25.53 25.02,25.53 24.51,26.04 18.67,26.04 18.41,26.29 | 18.41,26.29 R34.1
N$54
  Bottom 0.254: R11.2 30.73,16 | U1.13 31.88,16.51 31.24,15.88 R11.2 | R11.2 30.73,16.13 | U$6.6 16.51,12.06 16,12.06 15.24,12.83 15.24,14.1 15.49,14.1 16.51,15.11 R36.1 17.53,16.26 30.73,16.26 R11.2
N$55
  Bottom 0.254: U$7.6 74.68,5.71 74.68,3.17 R38.1 73.91,3.17 73.28,2.54 59.69,2.54 R13.2 57.4,4.83 57.4,5.84 56.13,7.11 55.75,7.11 55.5,7.37 53.85,7.37 51.44,9.78 49.02,9.78 49.02,10.67 U1.15
N$56
  Bottom 0.254: U$8.6 74.68,13.34 74.68,10.79 R40.1 71.12,10.79 70.48,10.16 58.8,10.16 56.52,12.45 54.61,12.45 54.36,12.7 R15.2 53.34,12.7 53.34,15.11 50.67,18.1 48.9,18.1 48.13,18.54 46.23,18.54 U1.17
N$57
  Bottom 0.2: U$11.P$3 12.7,38.13
  Bottom 0.254: R49.2 29.08,39.37 | 12.7,38.13 12.7,38.1 12.83,37.97 19.43,37.97 20.95,39.5 20.95,40.13 21.72,40.89 26.29,40.89 27.43,39.75 28.07,39.75 28.45,39.37 28.96,39.37 R49.2 | 30.48,39.12 29.21,39.12 R49.2 | 30.48,39.12 31.11,39.75 33.91,39.75 36.07,41.91 U1.3 | 30.48,39.12 D9.A
N$66
  Bottom 0.254: D2.A 29.46,4.19 32.51,4.19 32.89,3.81 R43.2
N$67
  Bottom 0.254: D1.A 40.01,3.81 41.27,3.81 41.53,4.06 41.91,4.06 R42.1
N$68
  Bottom 0.254: 9.65,44.45 9.65,46.35 U$10.2 | 9.65,44.45 9.65,43.18 9.02,42.55 8.89,42.55 U$11.P$1 | 9.65,44.45 8.64,44.45 7.37,45.72 R44.2
N$69
  Bottom 0.254: R44.1 D3.A
N$70
  Bottom 0.254: R45.1 22.48,45.34 22.86,45.34 D4.A
N$72
  Bottom 0.508: R22.1 U$5.8 11.56,21.72 11.56,24.26 5.59,24.26 4.32,22.99 4.32,13.34 | R20.1 77.85,39.37 79.76,37.47 79.76,37.08 U$3.8 79.76,36.58 82.04,34.29 84.2,34.29 85.22,33.27 91.06,33.27 | R23.1 17.27,7.49 13.91,7.49 11.24,9.84 11.56,10.67 U$6.8 11.3,10.92 11.3,11.81 9.78,13.34 4.32,13.34 | R25.1 79.76,14.35 79.76,13.59 U$8.8 79.76,13.08 79.76,12.32 81.41,10.67 85.6,10.67 86.11,11.18 87.76,11.18 88.39,10.54 93.85,10.54 | R18.1 81.53,31.37 80.9,31.37 79.76,30.23 79.76,28.96 U$2.8 79.76,28.7 82.04,26.42 82.42,26.42 82.93,25.91 91.06,25.91 | 81.66,8.26 R24.1 | R19.1 81.53,24.13 79.76,22.35 79.76,21.84 U$1.8 79.76,21.34 82.04,19.05 89.28,19.05 92.33,16 92.71,16 | R21.1 73.41,46.99 75.44,49.02 78.36,49.02 80.77,46.61 80.77,44.58 U$4.8 80.9,44.2 80.9,43.43 81.28,43.43 83.57,41.15 91.06,41.15 93.85,38.35 93.85,33.4 91.19,33.4 91.06,33.27 | 34.54,5.46 33.66,6.35 R43.1 | 36.07,3.94 34.54,5.46 | 36.07,3.94 D1.K 36.96,3.05 36.96,2.16 38.61,0.51 40.13,0.51 40.77,1.14 55.88,1.14 56.52,0.51 58.42,0.51 59.05,1.14 77.98,1.14 79.76,2.92 | U$9.1 34.8,5.59 34.67,5.59 34.54,5.46 | 36.07,3.94 33.91,1.78 9.53,1.78 4.32,6.99 4.32,13.34 | 79.76,2.92 79.76,5.46 U$7.8 | 79.76,2.92 92.58,2.92 93.85,4.19 93.85,10.54 | 92.71,16 93.85,14.86 93.85,10.54 | 91.06,25.91 93.85,23.11 93.85,16.13 92.84,16.13 92.71,16 | 91.06,33.27 93.85,30.48 93.85,26.04 91.19,26.04 91.06,25.91
  Bottom 0.61: 81.66,8.26 81.66,8 80.01,6.35 80.01,6.03 U$7.8